# Altium schematic sheet ST_LINK.SCHDOC
size A4; Revision: C.2
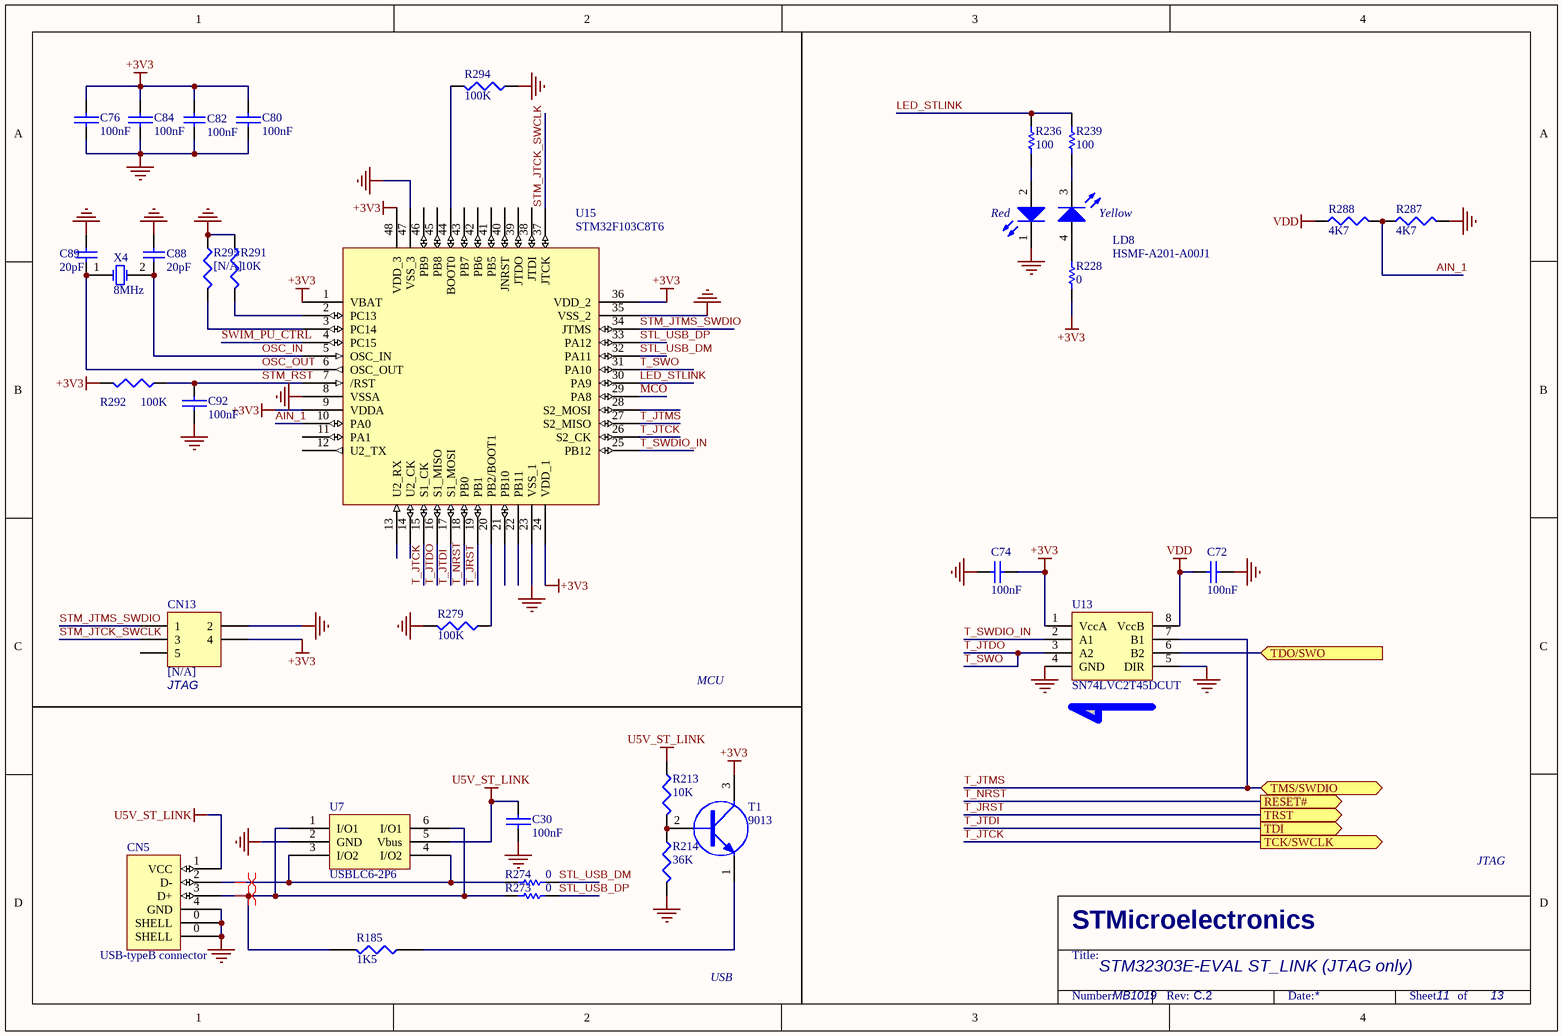
[diagram p0: ST_LINK.SCHDOC]

## Parts
C30  100nF  [0603C]
C72  100nF  [0603C]
C74  100nF  [0603C]
C76  100nF  [0603C]
C80  100nF  [0603C]
C82  100nF  [0603C]
C84  100nF  [0603C]
C88  20pF  [0603C]
C89  20pF  [0603C]
C92  100nF  [0603C]
CN5  USB-typeB connector  [USB-B]
CN13  [N/A]  [2*3P]
LD8  HSMF-A201-A00J1  [LED2-28*32]
R185  1K5  [0603R]
R213  10K  [0603R]
R214  36K  [0603R]
R228  0  [0603R]
R236  100  [0603R]
R239  100  [0603R]
R273  0  [0603R]
R274  0  [0603R]
R279  100K  [0603R]
R287  4K7  [0603R]
R288  4K7  [0603R]
R291  10K  [0603R]
R292  100K  [0603R]
R294  100K  [0603R]
R295  [N/A]  [0603R]
T1  9013  [SOT-23]
U7  USBLC6-2P6  [SOT-666]
U13  SN74LVC2T45DCUT  [VSSOP8]
U15  STM32F103C8T6  [LQFP48]
X4  8MHz  [SMT_XTAL]

## Ports
RESET# (out), TCK/SWCLK (out), TDI (out), TDO/SWO (in), TMS/SWDIO (bidir), TRST (out)

## Nets
+3V3: C74.2 C76.2 C80.2 C82.1 C84.2 CN13.4 R228.2 R292.2 T1.3(C) U13.1(VccA) U15.1(VBAT) U15.9(VDDA) U15.24(VDD_1) U15.36(VDD_2) U15.48(VDD_3)
GND: C30.2 C72.2 C74.1 C76.1 C80.1 C82.2 C84.1 C88.1 C89.1 C92.1 CN5.0(SHELL) CN5.4(GND) CN13.2 LD8.1(RED_cathode) R214.2 R279.2 R287.2 R291.1 R294.1 R295.1 U7.2(GND) U13.4(GND) U13.5(DIR) U15.8(VSSA) U15.23(VSS_1) U15.35(VSS_2) U15.47(VSS_3)
U5V_ST_LINK: C30.1 CN5.1(VCC) R213.1 U7.5(Vbus)
VDD: C72.1 R288.1 U13.8(VccB)
AIN_1: R287.1 R288.2 U15.10(PA0)
LED_STLINK: R236.1 R239.1 U15.30(PA9)
MCO: U15.29(PA8)
OSC_IN: C88.2 U15.5(OSC_IN) X4.2(OSC2)
OSC_OUT: C89.2 U15.6(OSC_OUT) X4.1(OSC1)
STL_USB_DM: R274.1 U15.32(PA11)
STL_USB_DP: R273.1 U15.33(PA12)
STM_JTCK_SWCLK: CN13.3 U15.37(JTCK)
STM_JTMS_SWDIO: CN13.1 U15.34(JTMS)
STM_RST: C92.2 R292.1 U15.7(/RST)
SWIM_PU_CTRL: U15.4(PC15)
T_JRST: U15.19(PB1) ; port TRST
T_JTCK: U15.15(S1_CK) U15.26(S2_CK) ; port TCK/SWCLK
T_JTDI: U15.17(S1_MOSI) ; port TDI
T_JTDO: U13.3(A2) U15.16(S1_MISO) U15.31(PA10)  [also labelled T_SWO]
T_JTMS: U13.7(B1) U15.27(S2_MISO) ; port TMS/SWDIO
T_NRST: U15.18(PB0) ; port RESET#
T_SWDIO_IN: U13.2(A1) U15.25(PB12)
TDO/SWO: U13.6(B2) ; port TDO/SWO
NetCN5_2: CN5.2(D-) R274.2 U7.3(I/O2) U7.4(I/O2)
NetCN5_3: CN5.3(D+) R185.2 R273.2 U7.1(I/O1) U7.6(I/O1)
NetLD8_2: LD8.2(Red_anode) R236.2
NetLD8_3: LD8.3(YellowGreen_cathode) R239.2
NetLD8_4: LD8.4(YellowGreen_anode) R228.1
NetR185_1: R185.1 T1.1(E)
NetR213_2: R213.2 R214.1 T1.2(B)
NetR279_1: R279.1 U15.20(PB2/BOOT1)
NetR291_2: R291.2 U15.2(PC13)
NetR294_2: R294.2 U15.44(BOOT0)
NetR295_2: R295.2 U15.3(PC14)

Not connected (* = marked no-connect by the designer): CN13 5; U15 11(PA1) 12(U2_TX) 13(U2_RX) 14(U2_CK) 21(PB10) 22(PB11) 28(S2_MOSI) 38(JTDI) 39(JTDO) 40(JNRST) 41(PB5) 42(PB6) 43(PB7) 45(PB8) 46(PB9)

## Layout directives
differential pair: NetCN5_2, NetCN5_3

## Notes on the sheet
- (near CN13) JTAG
- MCU
- JTAG
- USB
- STM32303E-EVAL ST_LINK (JTAG only)
- MB1019
- 11
- 13
- STMicroelectronics
- Title:
- Number:
- Rev:
- Date:
- Sheet       of
- (in symbol HSMF-A201-A00J1) Red; Yellow

## Library data of the parts
C30 = CAP: Capacitor
C72 C74 = CAP: Capacitor; Value: 100pF; Published: 8-Jun-2000; Revision: July-2002: Re-released for DXP Platform.; Publisher: Altium Limited
C76 C80 C84 C92 = CAP
C82 = Cap: Capacitor; Value: 10nF; Published: 8-Jun-2000; Revision: July-2002: Re-released for DXP Platform.; Publisher: Altium Limited
C88 C89 = Cap: Capacitor; Published: 8-Jun-2000; LatestRevisionDate: 17-Jul-2002; LatestRevisionNote: Re-released for DXP Platform.; PackageReference: RAD-0.3; Publisher: Altium Limited; Value: 20pF
CN13 = Header 3X2: Header, 3-Pin, Dual row; Revision: 17-Jul-2002: Re-released for DXP Platform.; Publisher: Altium Limited
R185 R279 R287 R288 R292 R294 = RES1
R213 R214 R291 R295 = R: Right: 20; Bottom: 30
R228 R236 R239 R273 R274 = Res1: Resistor; Value: 1K; Published: 8-Jun-2000; Revision: July-2002: Re-released for DXP Platform.; Publisher: Altium Limited
T1 = NPN
U7 = USBLC6-2
U15 = STM32F10x(48pin)
X4 = XTAL: Crystal Oscillator; Published: 8-Jun-2000; LatestRevisionDate: 17-Jul-2002; LatestRevisionNote: Re-released for DXP Platform.; PackageReference: R38; Publisher: Altium Limited